# EAGLE design CD_Cap_brd (EAGLE 7.2.0)
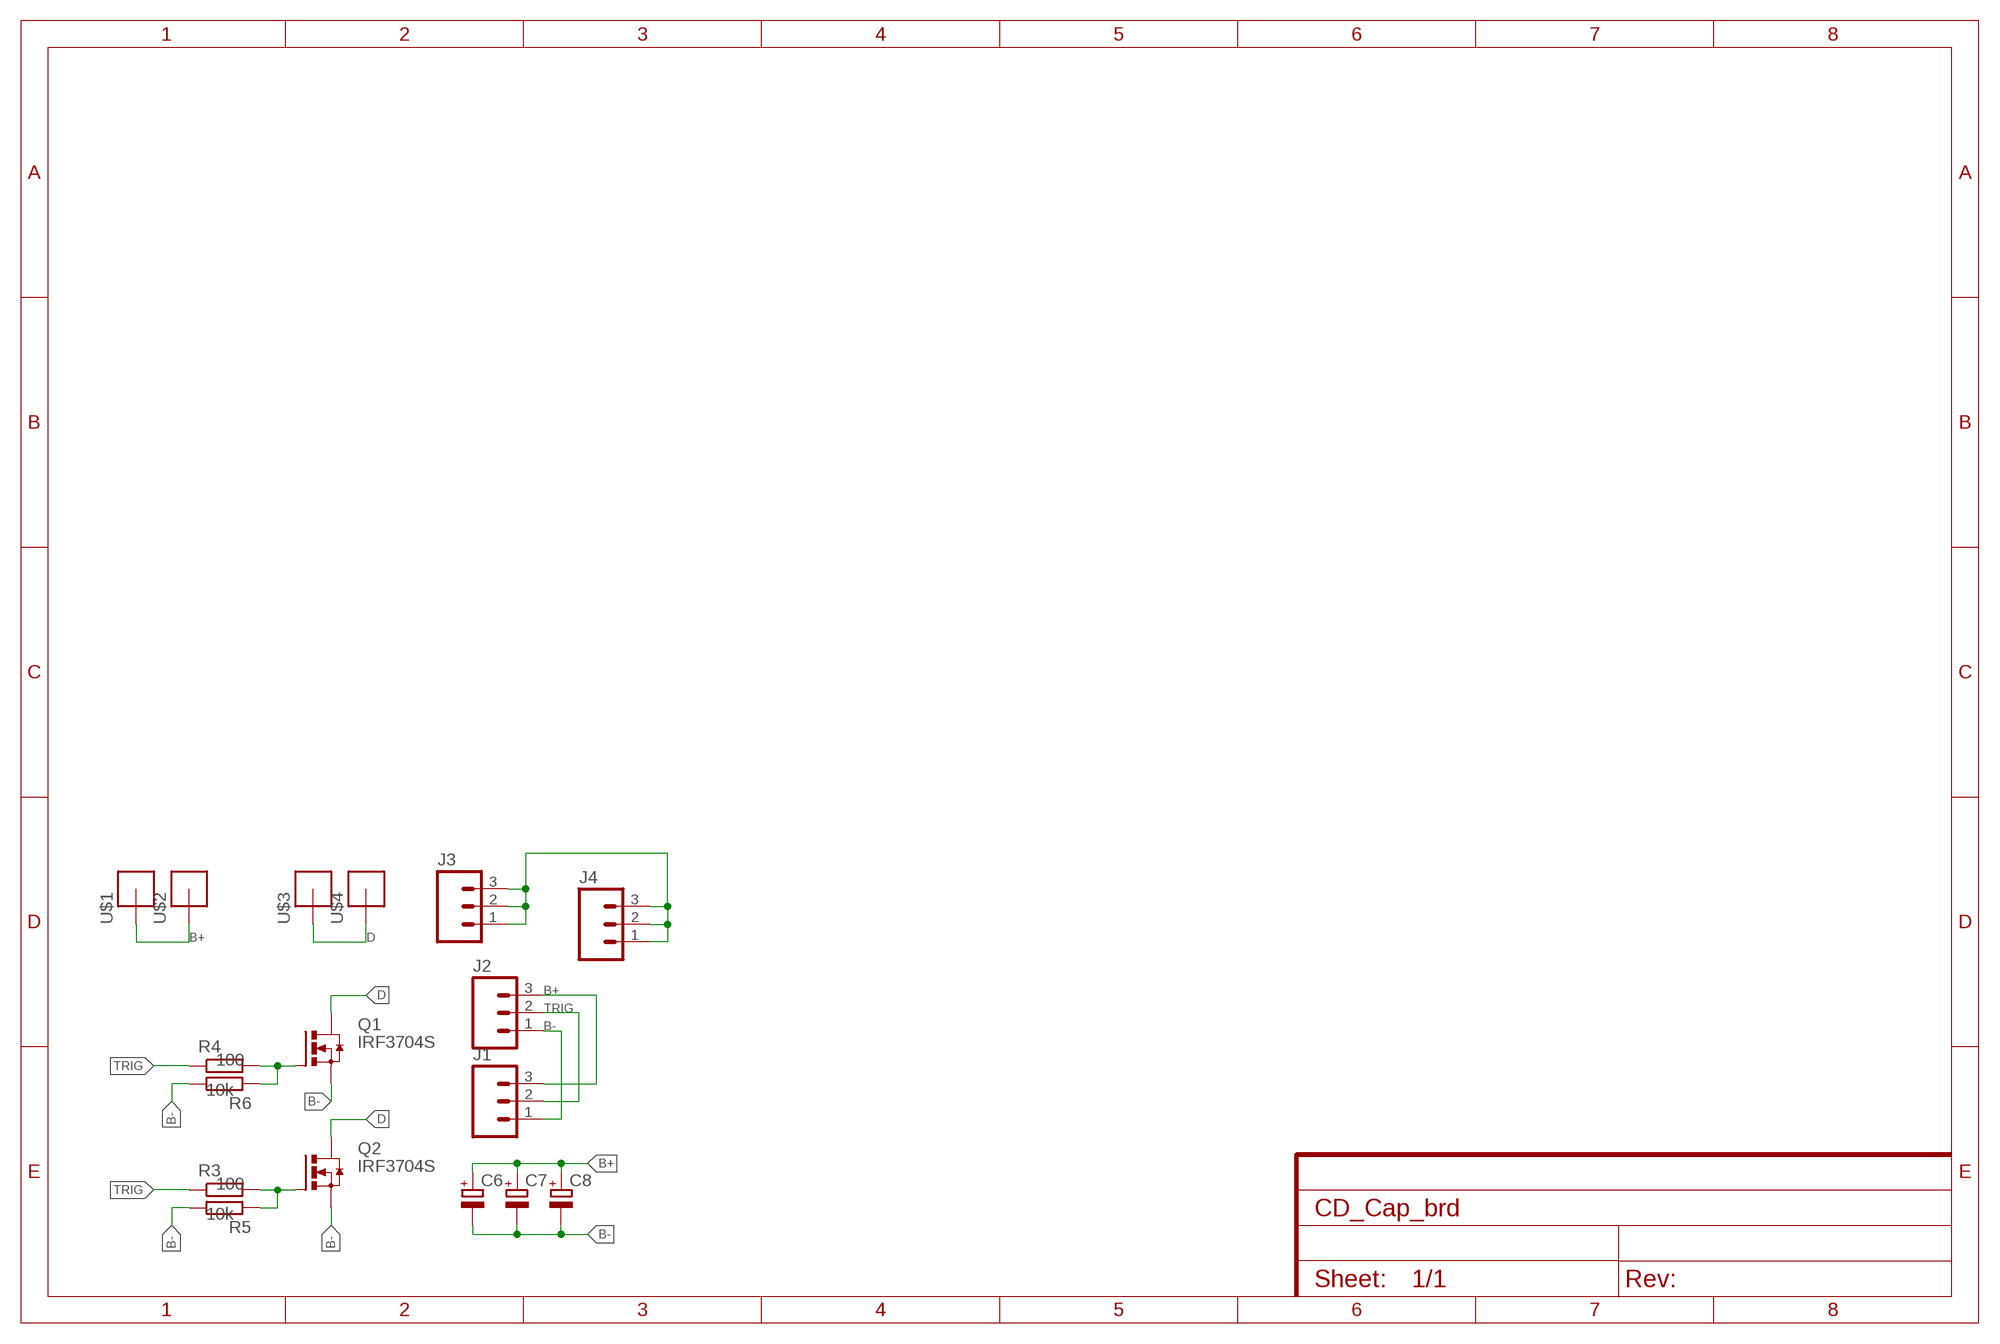
[diagram p0: schematic, sheet 1]

## Parts
C6  CPOL-EUE10-35  [EB35D]
C7  CPOL-EUE10-35  [EB35D]
C8  CPOL-EUE10-35  [EB35D]
J1  M03PTH  [1X03]
J2  M03PTH  [1X03]
J3  M03LOCK  [1X03_LOCK]
J4  M03LOCK  [1X03_LOCK]
Q1  IRF3704S  [D2PACK]
Q2  IRF3704S  [D2PACK]
R3  100  RESISTOR0603-N  [R0603-N]
R4  100  RESISTOR0603-N  [R0603-N]
R5  10k  RESISTOR0603-N  [R0603-N]
R6  10k  RESISTOR0603-N  [R0603-N]
U$1  BIG_PINHEADX110-32  [M6_PINHEAD]
U$2  BIG_PINHEADX110-32  [M6_PINHEAD]
U$3  BIG_PINHEADX110-32  [M6_PINHEAD]
U$4  BIG_PINHEADX110-32  [M6_PINHEAD]

## Nets
B+: C6.+ C7.+ C8.+ J1.3 J2.3 U$1.P$1 U$2.P$1
B-: C6.- C7.- C8.- J1.1 J2.1 J3.1 J3.2 J3.3 J4.1 J4.2 J4.3 Q1.3(S) Q2.3(S) R5.2 R6.2
D: Q1.2(D) Q2.2(D) U$3.P$1 U$4.P$1
N$1: Q1.1(G) R4.2 R6.1
N$4: Q2.1(G) R3.2 R5.1
TRIG: J1.2 J2.2 R3.1 R4.1

## Library data of the parts
C6-C8 = resistor:CPOL-EU: POLARIZED CAPACITOR, European symbol
J1-J4 = SparkFun-Connectors:M03: Header 3 Standard 3-pin 0.1" header. Use with straight break away headers (SKU : PRT-00116), right angle break away headers (PRT-00553), swiss pins (PRT-00743), machine pins (PRT-00117), and female headers (PRT-00115). Molex polarized connector foot print use with SKU : PRT-08232 with associated crimp pins and housings.
Q1 Q2 = transistor-power:IRF3704: SMPS MOSFET HEXFET® Power MOSFET Source: http://www.irf.com/product-info/datasheets/data/irf3704.pdf
R3-R6 = passives-7351:RESISTOR
U$1-U$4 = _my-parts:BIG_PINHEADX1

## Board
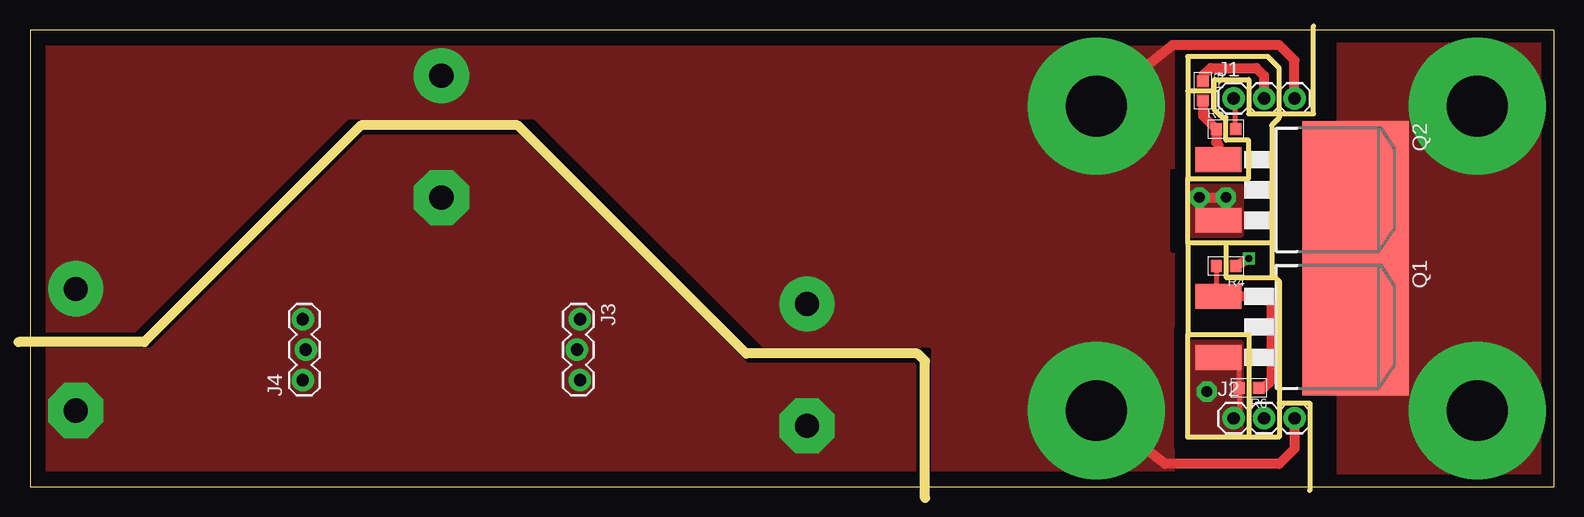
[diagram p1: board, top side]
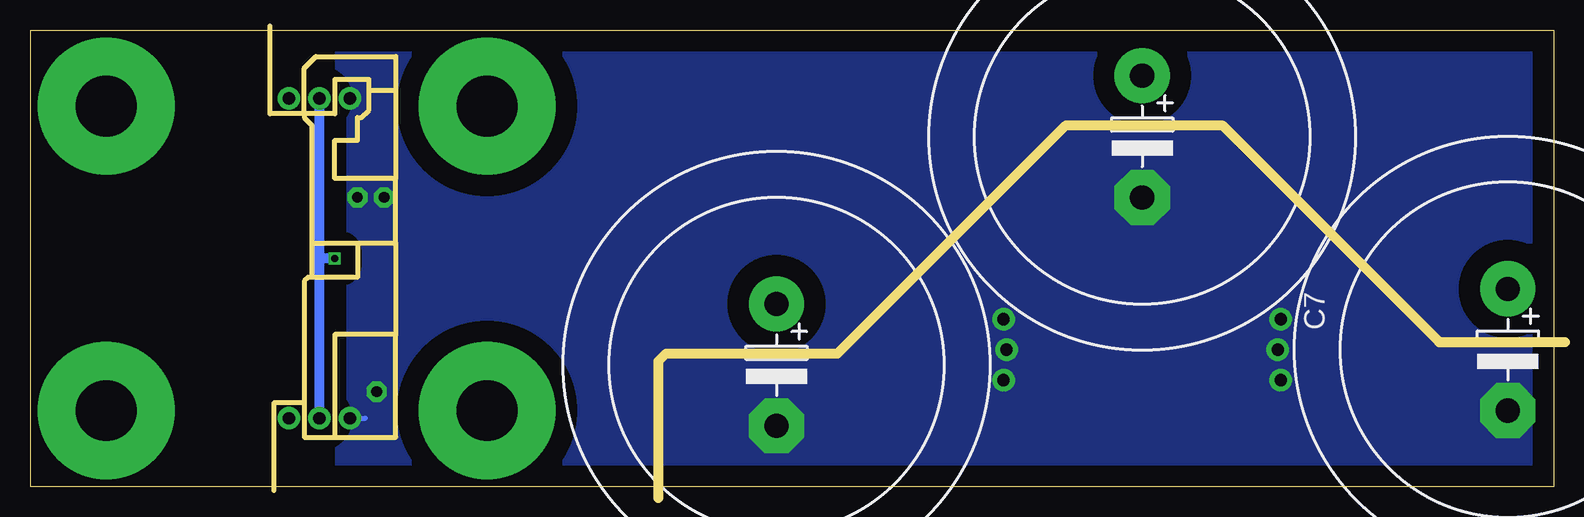
[diagram p2: board, bottom side, seen from below]

Size 127 x 38.1 mm. Coordinates in mm from the lower left corner, seen from the top.
Outline: 0,0 127,0 127,38.1 0,38.1 0,0
Copper layers (1*16): Top 0.035mm / dielectric 1.5mm / Bottom 0.035mm
Design rules "default": minimum track width 10mil, minimum drill 24mil, track to track 8mil, track to pad 8mil, pad to pad 8mil, via to via 8mil, smd to smd 8mil, copper to edge 40mil, drill to drill 8mil, minimum pad ring 10mil, minimum via ring 8mil, stop-mask expansion 4mil, vias tented up to drill 0mil, thermal gap 10mil
Milling: 47 lines

### Footprints (pad centres in the part's own frame; a part is rotated, then mirrored left to right if it is on the bottom)
EB35D = drill 2.007 pad 4.597: + -5.08,0 | drill 2.007 pad 4.597 octagon: - 5.08,0
1X03 = drill 1.016 pad 1.88: 1 0,0; 2 2.54,0; 3 5.08,0
1X03_LOCK = drill 1.016 pad 1.88: 1 0,0.127; 2 2.54,-0.127; 3 5.08,0.127
D2PACK = smd 2.083 x 3.81: 1 -2.54,-8.89; 3 2.54,-8.89 | smd 11.43 x 8.89: 2 0,2.54
R0603-N = smd 0.95 x 1: 1 -0.8,0; 2 0.8,0
M6_PINHEAD = drill 5.08 pad 11.43: P$1 0,0

### Placement (x,y rotation side)
C6  3.81,11.43 270 bottom
C7  34.29,29.21 270 bottom
C8  64.77,10.16 270 bottom
J1  100.33,32.38 0 top
J2  100.33,5.71 0 top
J3  45.72,13.97 270 top
J4  22.86,8.89 90 top
Q1  107.95,13.34 270 top
Q2  107.95,24.77 270 top
R3  97.79,33.02 270 top
R4  99.69,18.41 180 top
R5  99.69,29.84 0 top
R6  101.6,8.26 180 top
U$1  88.9,31.75 0 top
U$2  88.9,6.35 0 top
U$3  120.65,31.75 0 top
U$4  120.65,6.35 0 top

### Tracks (layer width: path | path; a pad name or v marks a point on that pad's centre or on a via)
B+
  Top 0.813: J2.3 105.41,3.17 104.14,1.91 94.61,1.91 U$2.P$1 | J1.3 105.41,35.56 104.14,36.83 95.25,36.83 U$1.P$1
  pour Top (isolate 1.27, rank 2, no thermals): 0,10.16 10.16,10.16 29.21,27.94 39.37,27.94 59.69,8.89 72.39,8.89 72.39,0 95.25,0 95.25,38.1 0,38.1
B-  (via drill 0.89 pad 1.68)
  Top 0.406: J2.1 100.8,6.18 R6.2 100.8,10.32 100.33,10.79 Q1.3 | R5.2 100.5,32.22 J1.1
  Top 0.813: v97.47,24.13 99.38,24.13 99.69,23.81 v99.69,24.13 99.69,22.86 Q2.3
  Bottom 0.406: J2.1 99.06,5.71
  other vias: 98.11,7.94
  pour Bottom (isolate 1.778, no thermals): 0,0 101.28,0.32 101.28,38.42 0,38.1
  pour Top (isolate 1.27, no thermals): 0,0 0,11.43 10.16,11.43 27.94,29.21 40.64,29.21 59.69,10.16 73.66,10.16 73.66,0
  pour Top (no thermals): 100.97,12.06 100.97,4.45 96.84,4.45 96.84,12.06
  pour Top (no thermals): 100.97,20.95 96.52,20.95 96.52,25.08 100.97,25.08
D
  pour Top (no thermals): 127,38.1 127,0 109.22,0 109.22,38.1
N$1
  Top 0.406: R4.2 98.89,16.04 Q1.1
  Top 0.813: R6.1 102.87,8.26 103.5,8.89 103.5,15.24 102.87,15.88 Q1.1
N$4
  Top 0.813: Q2.1 99.06,28.57 98.89,28.74 R5.1 97.79,30.95 R3.2
TRIG  (via drill 0.6)
  Top 0.813: R4.1 v101.6,19.05 | R3.1 97.79,34.29 98.42,34.92 102.23,34.92 102.87,34.29 J1.2
  Bottom 0.813: J2.2 102.87,19.05 | 102.87,19.05 J1.2 | v101.6,19.05 102.87,19.05